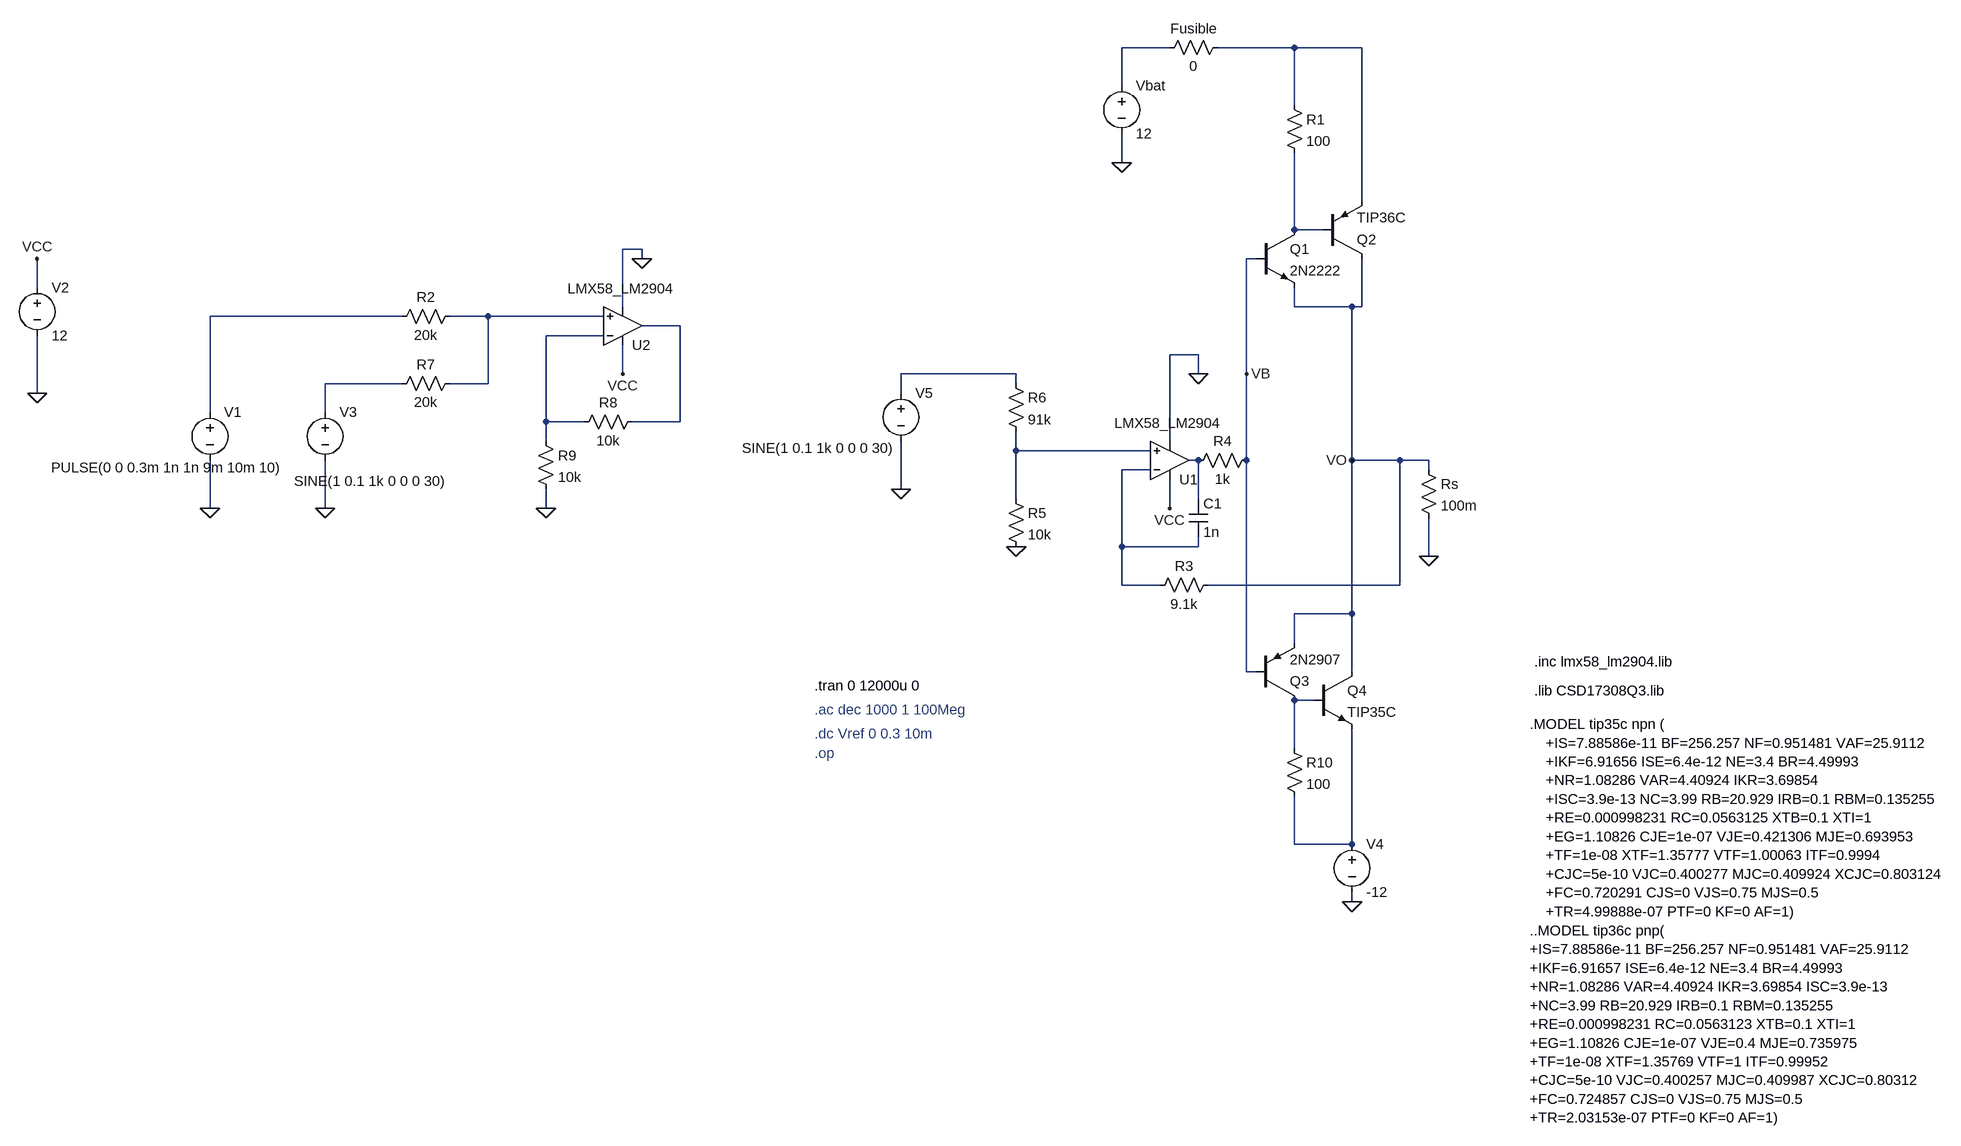
[diagram p0: schematic howland_current_pump.asc]
howland_current_pump.asc, the LTspice schematic file:
Version 4.1
SHEET 1 2496 680
WIRE 640 -1168 560 -1168
WIRE 848 -1168 720 -1168
WIRE 960 -1168 848 -1168
WIRE 560 -1104 560 -1168
WIRE 848 -1072 848 -1168
WIRE 560 -976 560 -1024
WIRE 960 -912 960 -1168
WIRE 848 -864 848 -992
WIRE 896 -864 848 -864
WIRE -320 -832 -352 -832
WIRE -320 -816 -320 -832
WIRE 784 -816 768 -816
WIRE -1328 -768 -1328 -816
WIRE -352 -736 -352 -832
WIRE 848 -736 848 -768
WIRE 944 -736 848 -736
WIRE 960 -736 960 -816
WIRE 960 -736 944 -736
WIRE -720 -720 -1040 -720
WIRE -576 -720 -640 -720
WIRE -384 -720 -576 -720
WIRE -256 -704 -320 -704
WIRE -384 -688 -480 -688
WIRE 688 -656 640 -656
WIRE -352 -624 -352 -672
WIRE 384 -624 192 -624
WIRE 688 -624 688 -656
WIRE 768 -624 768 -816
WIRE -720 -608 -848 -608
WIRE -576 -608 -576 -720
WIRE -576 -608 -640 -608
WIRE 384 -608 384 -624
WIRE -1328 -592 -1328 -688
WIRE 192 -592 192 -624
WIRE -1040 -560 -1040 -720
WIRE -848 -560 -848 -608
WIRE -480 -544 -480 -688
WIRE -416 -544 -480 -544
WIRE -256 -544 -256 -704
WIRE -256 -544 -336 -544
WIRE -480 -512 -480 -544
WIRE 640 -512 640 -656
WIRE 384 -496 384 -528
WIRE 608 -496 384 -496
WIRE 688 -480 672 -480
WIRE 768 -480 768 -624
WIRE 944 -480 944 -736
WIRE 1024 -480 944 -480
WIRE 1072 -480 1024 -480
WIRE 608 -464 560 -464
WIRE 1072 -464 1072 -480
WIRE 192 -432 192 -512
WIRE 384 -416 384 -496
WIRE 688 -416 688 -480
WIRE -1040 -400 -1040 -480
WIRE -848 -400 -848 -480
WIRE -480 -400 -480 -432
WIRE 640 -400 640 -448
WIRE 560 -336 560 -464
WIRE 688 -336 688 -352
WIRE 688 -336 560 -336
WIRE 1072 -320 1072 -384
WIRE 560 -272 560 -336
WIRE 624 -272 560 -272
WIRE 1024 -272 1024 -480
WIRE 1024 -272 704 -272
WIRE 944 -224 944 -480
WIRE 944 -224 848 -224
WIRE 848 -176 848 -224
WIRE 768 -128 768 -480
WIRE 784 -128 768 -128
WIRE 944 -128 944 -224
WIRE 880 -80 848 -80
WIRE 848 0 848 -80
WIRE 848 160 848 80
WIRE 944 160 944 -32
WIRE 944 160 848 160
WIRE 944 256 944 240
FLAG 1072 -320 0
FLAG -1328 -816 VCC
FLAG -1328 -592 0
FLAG 640 -400 VCC
FLAG -1040 -400 0
FLAG 560 -976 0
FLAG 384 -336 0
FLAG -352 -624 VCC
FLAG -320 -816 0
FLAG -848 -400 0
FLAG 944 256 0
FLAG -480 -400 0
FLAG 192 -432 0
FLAG 768 -624 VB
FLAG 944 -480 VO
FLAG 688 -624 0
SYMBOL OpAmps\\opamp2 640 -416 M180
WINDOW 3 -92 126 Left 2
SYMATTR Value LMX58_LM2904
SYMATTR InstName U1
SYMBOL voltage -1328 -784 R0
WINDOW 123 0 0 Left 0
WINDOW 39 0 0 Left 0
SYMATTR InstName V2
SYMATTR Value 12
SYMBOL res 1056 -480 R0
SYMATTR InstName Rs
SYMATTR Value 100m
SYMBOL voltage 560 -1120 R0
WINDOW 123 0 0 Left 0
WINDOW 39 0 0 Left 0
SYMATTR InstName Vbat
SYMATTR Value 12
SYMBOL npn 784 -864 R0
SYMATTR InstName Q1
SYMATTR Value 2N2222
SYMBOL voltage -1040 -576 R0
WINDOW 3 -265 108 Left 2
WINDOW 123 0 0 Left 0
WINDOW 39 0 0 Left 0
SYMATTR Value PULSE(0 0 0.3m 1n 1n 9m 10m 10)
SYMATTR InstName V1
SYMBOL pnp 896 -816 M180
SYMATTR InstName Q2
SYMATTR Value TIP36C
SYMBOL res 832 -1088 R0
SYMATTR InstName R1
SYMATTR Value 100
SYMBOL res 608 -256 R270
WINDOW 0 32 56 VTop 2
WINDOW 3 0 56 VBottom 2
SYMATTR InstName R3
SYMATTR Value 9.1k
SYMBOL cap 672 -416 R0
SYMATTR InstName C1
SYMATTR Value 1n
SYMBOL res 784 -496 R90
WINDOW 0 0 56 VBottom 2
WINDOW 3 32 56 VTop 2
SYMATTR InstName R4
SYMATTR Value 1k
SYMBOL res 368 -432 R0
SYMATTR InstName R5
SYMATTR Value 10k
SYMBOL res 368 -624 R0
SYMATTR InstName R6
SYMATTR Value 91k
SYMBOL res 736 -1184 R90
WINDOW 0 0 56 VBottom 2
WINDOW 3 32 56 VTop 2
SYMATTR InstName Fusible
SYMATTR Value 0
SYMBOL OpAmps\\opamp2 -352 -640 M180
WINDOW 3 -92 126 Left 2
SYMATTR Value LMX58_LM2904
SYMATTR InstName U2
SYMBOL res -624 -736 R90
WINDOW 0 0 56 VBottom 2
WINDOW 3 32 56 VTop 2
SYMATTR InstName R2
SYMATTR Value 20k
SYMBOL res -320 -560 R90
WINDOW 0 0 56 VBottom 2
WINDOW 3 32 56 VTop 2
SYMATTR InstName R8
SYMATTR Value 10k
SYMBOL voltage -848 -576 R0
WINDOW 123 0 0 Left 0
WINDOW 39 0 0 Left 0
WINDOW 3 -52 131 Left 2
SYMATTR Value SINE(1 0.1 1k 0 0 0 30)
SYMATTR InstName V3
SYMBOL pnp 784 -80 M180
SYMATTR InstName Q3
SYMATTR Value 2N2907
SYMBOL npn 880 -128 R0
SYMATTR InstName Q4
SYMATTR Value TIP35C
SYMBOL res 832 -16 R0
SYMATTR InstName R10
SYMATTR Value 100
SYMBOL res -624 -624 R90
WINDOW 0 0 56 VBottom 2
WINDOW 3 32 56 VTop 2
SYMATTR InstName R7
SYMATTR Value 20k
SYMBOL res -496 -528 R0
SYMATTR InstName R9
SYMATTR Value 10k
SYMBOL voltage 944 144 R0
WINDOW 123 0 0 Left 0
WINDOW 39 0 0 Left 0
SYMATTR InstName V4
SYMATTR Value -12
SYMBOL voltage 192 -608 R0
WINDOW 3 -265 108 Left 2
WINDOW 123 0 0 Left 0
WINDOW 39 0 0 Left 0
SYMATTR Value SINE(1 0.1 1k 0 0 0 30)
SYMATTR InstName V5
TEXT 1248 -144 Left 2 !.inc lmx58_lm2904.lib
TEXT 48 -104 Left 2 !.tran 0 12000u 0
TEXT 48 -64 Left 2 ;.ac dec 1000 1 100Meg
TEXT 1248 -96 Left 2 !.lib CSD17308Q3.lib
TEXT 48 -24 Left 2 ;.dc Vref 0 0.3 10m
TEXT 1240 -40 Left 2 !.MODEL tip35c npn (\n    +IS=7.88586e-11 BF=256.257 NF=0.951481 VAF=25.9112\n    +IKF=6.91656 ISE=6.4e-12 NE=3.4 BR=4.49993\n    +NR=1.08286 VAR=4.40924 IKR=3.69854\n    +ISC=3.9e-13 NC=3.99 RB=20.929 IRB=0.1 RBM=0.135255\n    +RE=0.000998231 RC=0.0563125 XTB=0.1 XTI=1\n    +EG=1.10826 CJE=1e-07 VJE=0.421306 MJE=0.693953\n    +TF=1e-08 XTF=1.35777 VTF=1.00063 ITF=0.9994\n    +CJC=5e-10 VJC=0.400277 MJC=0.409924 XCJC=0.803124\n    +FC=0.720291 CJS=0 VJS=0.75 MJS=0.5\n    +TR=4.99888e-07 PTF=0 KF=0 AF=1)
TEXT 1240 304 Left 2 !..MODEL tip36c pnp(\n+IS=7.88586e-11 BF=256.257 NF=0.951481 VAF=25.9112\n+IKF=6.91657 ISE=6.4e-12 NE=3.4 BR=4.49993\n+NR=1.08286 VAR=4.40924 IKR=3.69854 ISC=3.9e-13\n+NC=3.99 RB=20.929 IRB=0.1 RBM=0.135255\n+RE=0.000998231 RC=0.0563123 XTB=0.1 XTI=1\n+EG=1.10826 CJE=1e-07 VJE=0.4 MJE=0.735975\n+TF=1e-08 XTF=1.35769 VTF=1 ITF=0.99952\n+CJC=5e-10 VJC=0.400257 MJC=0.409987 XCJC=0.80312\n+FC=0.724857 CJS=0 VJS=0.75 MJS=0.5\n+TR=2.03153e-07 PTF=0 KF=0 AF=1)
TEXT 48 8 Left 2 ;.op

The netlist it stands for:
* howland_current_pump.asc
X§U1 N010 N012 VCC 0 N011 LMX58_LM2904  ; pins In+ In- V+ V- OUT
V2 VCC 0 12
Rs VO 0 100m
Vbat N001 0 12
Q1 N003 VB VO 0 2N2222
V1 N004 0 PULSE(0 0 0.3m 1n 1n 9m 10m 10)
Q2 VO N003 N002 0 TIP36C
R1 N002 N003 100
R3 N012 VO 9.1k
C1 N011 N012 1n
R4 VB N011 1k
R5 N010 0 10k
R6 N008 N010 91k
R§Fusible N002 N001 0
X§U2 N005 N007 VCC 0 N006 LMX58_LM2904  ; pins In+ In- V+ V- OUT
R2 N005 N004 20k
R8 N006 N007 10k
V3 N009 0 SINE(1 0.1 1k 0 0 0 30)
Q3 N013 VB VO 0 2N2907
Q4 VO N013 N014 0 TIP35C
R10 N013 N014 100
R7 N005 N009 20k
R9 N007 0 10k
V4 N014 0 -12
V5 N008 0 SINE(1 0.1 1k 0 0 0 30)
.model NPN NPN
.model PNP PNP
.lib standard.bjt
.inc lmx58_lm2904.lib
.tran 0 12000u 0
* .ac dec 1000 1 100Meg
.lib CSD17308Q3.lib
* .dc Vref 0 0.3 10m
.MODEL tip35c npn (
    +IS=7.88586e-11 BF=256.257 NF=0.951481 VAF=25.9112
    +IKF=6.91656 ISE=6.4e-12 NE=3.4 BR=4.49993
    +NR=1.08286 VAR=4.40924 IKR=3.69854
    +ISC=3.9e-13 NC=3.99 RB=20.929 IRB=0.1 RBM=0.135255
    +RE=0.000998231 RC=0.0563125 XTB=0.1 XTI=1
    +EG=1.10826 CJE=1e-07 VJE=0.421306 MJE=0.693953
    +TF=1e-08 XTF=1.35777 VTF=1.00063 ITF=0.9994
    +CJC=5e-10 VJC=0.400277 MJC=0.409924 XCJC=0.803124
    +FC=0.720291 CJS=0 VJS=0.75 MJS=0.5
    +TR=4.99888e-07 PTF=0 KF=0 AF=1)
..MODEL tip36c pnp(
+IS=7.88586e-11 BF=256.257 NF=0.951481 VAF=25.9112
+IKF=6.91657 ISE=6.4e-12 NE=3.4 BR=4.49993
+NR=1.08286 VAR=4.40924 IKR=3.69854 ISC=3.9e-13
+NC=3.99 RB=20.929 IRB=0.1 RBM=0.135255
+RE=0.000998231 RC=0.0563123 XTB=0.1 XTI=1
+EG=1.10826 CJE=1e-07 VJE=0.4 MJE=0.735975
+TF=1e-08 XTF=1.35769 VTF=1 ITF=0.99952
+CJC=5e-10 VJC=0.400257 MJC=0.409987 XCJC=0.80312
+FC=0.724857 CJS=0 VJS=0.75 MJS=0.5
+TR=2.03153e-07 PTF=0 KF=0 AF=1)
* .op
.backanno
.end